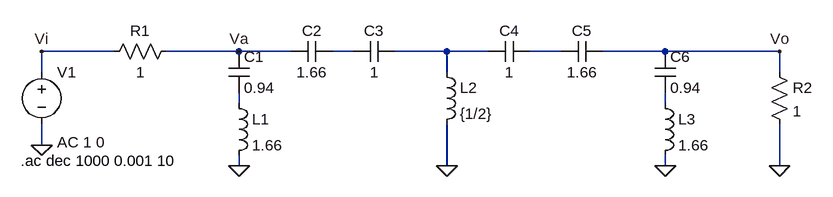
[diagram p0: schematic ej1-a.asc]
ej1-a.asc, the LTspice schematic file:
Version 4
SHEET 1 1144 692
WIRE 64 112 -48 112
WIRE 256 112 144 112
WIRE 336 112 256 112
WIRE 432 112 400 112
WIRE 576 112 496 112
WIRE 640 112 576 112
WIRE 752 112 704 112
WIRE 912 112 816 112
WIRE 1088 112 912 112
WIRE -48 144 -48 112
WIRE 576 144 576 112
WIRE 1088 144 1088 112
WIRE 256 192 256 176
WIRE 912 192 912 176
WIRE -48 256 -48 224
WIRE 256 288 256 272
WIRE 576 288 576 224
WIRE 912 288 912 272
WIRE 1088 288 1088 224
FLAG -48 256 0
FLAG 256 288 0
FLAG 576 288 0
FLAG 912 288 0
FLAG 1088 288 0
FLAG -48 112 Vi
FLAG 256 112 Va
FLAG 1088 112 Vo
SYMBOL voltage -48 128 R0
WINDOW 123 24 124 Left 2
WINDOW 39 0 0 Left 0
SYMATTR Value2 AC 1 0
SYMATTR InstName V1
SYMATTR Value ""
SYMBOL res 160 96 R90
WINDOW 0 0 56 VBottom 2
WINDOW 3 32 56 VTop 2
SYMATTR InstName R1
SYMATTR Value 1
SYMBOL cap 240 112 R0
SYMATTR InstName C1
SYMATTR Value 0.94
SYMBOL ind 240 176 R0
SYMATTR InstName L1
SYMATTR Value 1.66
SYMBOL cap 400 96 R90
WINDOW 0 0 32 VBottom 2
WINDOW 3 32 32 VTop 2
SYMATTR InstName C2
SYMATTR Value 1.66
SYMBOL cap 496 96 R90
WINDOW 0 0 32 VBottom 2
WINDOW 3 32 32 VTop 2
SYMATTR InstName C3
SYMATTR Value 1
SYMBOL ind 560 128 R0
SYMATTR InstName L2
SYMATTR Value {1/2}
SYMBOL cap 704 96 R90
WINDOW 0 0 32 VBottom 2
WINDOW 3 32 32 VTop 2
SYMATTR InstName C4
SYMATTR Value 1
SYMBOL cap 816 96 R90
WINDOW 0 0 32 VBottom 2
WINDOW 3 32 32 VTop 2
SYMATTR InstName C5
SYMATTR Value 1.66
SYMBOL cap 896 112 R0
SYMATTR InstName C6
SYMATTR Value 0.94
SYMBOL ind 896 176 R0
SYMATTR InstName L3
SYMATTR Value 1.66
SYMBOL res 1072 128 R0
SYMATTR InstName R2
SYMATTR Value 1
TEXT -80 280 Left 2 !.ac dec 1000 0.001 10

The netlist it stands for:
* ej1-a.asc
V1 Vi 0 AC 1 0
R1 Va Vi 1
C1 Va N004 0.94
L1 N004 0 1.66
C2 N001 Va 1.66
C3 N002 N001 1
L2 N002 0 {1/2}
C4 N003 N002 1
C5 Vo N003 1.66
C6 Vo N005 0.94
L3 N005 0 1.66
R2 Vo 0 1
.ac dec 1000 0.001 10
.backanno
.end

* Results of the author's LTspice run, read from the files saved beside the schematic
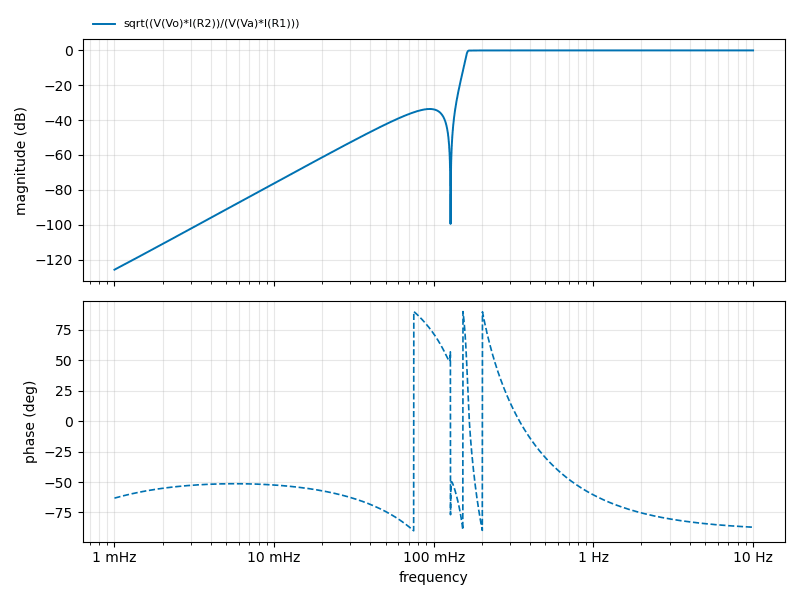
[diagram p1: AC Analysis of ej1-a.asc, plotted from the saved traces]
* AC Analysis, 1 run:
*   sqrt((V(Vo)*I(R2))/(V(Va)*I(R1))): -125.83 dB at 1 mHz, -0.00 dB at 10 Hz, peak -0.00 dB at 10 Hz, 3 dB below the peak at 159.8 mHz